# Altium project UrbanTurbinePCB.PrjPcb
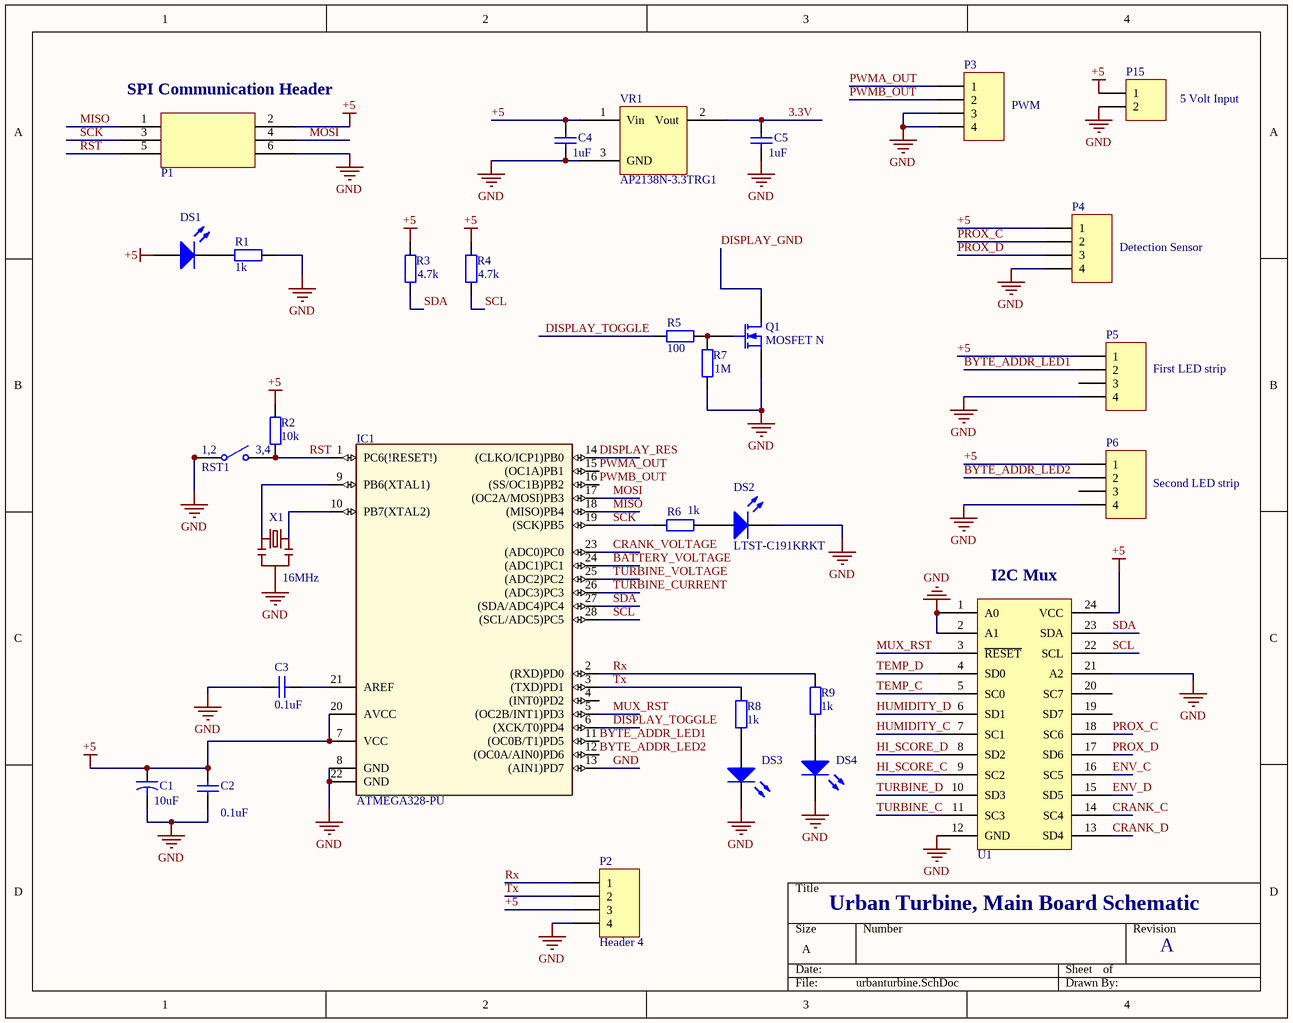
[diagram p0: urbanturbine.SchDoc]
3 sheets, 61 parts. Net scope: global (net labels, ports and power ports of the same name join across sheets).
Board files: urbanturbine_rev5a.PcbDoc, urbanturbine_rev6.PcbDoc
Sheets:
  urbanturbine.SchDoc
  sensors.SchDoc
  displays.SchDoc

## Sheet urbanturbine.SchDoc
size A

### Parts
C1  value 10uF  [CAPR5-4X5]  (hidden comment: Cap2)
C2  0.1uF  [RAD-0.1]
C3  value 0.1uF  [RAD-0.1]  (hidden comment: C1005X7R1H104K050BB)
C4  value 1uF  [RAD-0.1]  (hidden comment: Cap)
C5  value 1uF  [RAD-0.1]  (hidden comment: Cap)
DS1  LTST-C191KGKT  [LED-1]  (value not drawn)
DS2  LTST-C191KRKT  [LED-1]
DS3  LTST-C191KRKT  [LED-1]  (value not drawn)
DS4  LTST-C191KRKT  [LED-1]  (value not drawn)
IC1  ATMEGA328-PU  [*DIL28]
P1  M20-9980346  [2X3]  (value not drawn)
P2  Header 4  [HDR1X4]
P3  (no value)  [HDR1X4]
P4  (no value)  [HDR1X4]
P5  (no value)  [HDR1X4]
P6  (no value)  [HDR1X4]
P15  (no value)  [HDR1X2]
Q1  MOSFET N  [SOT23127P600-8N]
R1  value 1k  [AXIAL-0.4]  (hidden comment: RC0603JR-071KL)
R2  value 10k  [AXIAL-0.4]  (hidden comment: Res1)
R3  value 4.7k  [AXIAL-0.4]  (hidden comment: Res2)
R4  value 4.7k  [AXIAL-0.4]  (hidden comment: Res2)
R5  value 100  [AXIAL-0.4]  (hidden comment: ERJ-3EKF1002V)
R6  value 1k  [AXIAL-0.4]  (hidden comment: Res1)
R7  value 1M  [AXIAL-0.4]  (hidden comment: Res2)
R8  value 1k  [AXIAL-0.4]  (hidden comment: Res1)
R9  value 1k  [AXIAL-0.4]  (hidden comment: Res1)
RST1  PTS645SH50SMTR92 LFS  [TACTILE SWITCH SMD]  (value not drawn)
U1  TCA9548A  [TCA9548A]  (value not drawn)
VR1  AP2138N-3.3TRG1  [SOT23_M]
X1  16MHz  [RESONATOR-SMD]

### Nets
3.3V: C5.2 VR1.2(Vout)
+5: C1.1 C2.2 C4.2 DS1.1(A) IC1.7(VCC) IC1.20(AVCC) P1.2 P2.3 P4.1 P5.1 P6.1 P15.1 R2.1 R3.2 R4.2 U1.24(VCC) VR1.1(Vin)
GND: C1.2 C2.1 C3.2 C4.1 C5.1 DS2.2(K) DS3.2(K) DS4.2(K) IC1.8(GND) IC1.13((AIN1)PD7) IC1.22(GND) P1.6 P2.4 P3.3 P3.4 P4.4 P5.4 P6.4 P15.2 Q1.2(S) R1.2 R7.2 RST1.1 RST1.2 U1.1(A0) U1.2(A1) U1.12(GND) U1.21(A2) VR1.3(GND) X1.2
BATTERY_VOLTAGE: IC1.24((ADC1)PC1)
BYTE_ADDR_LED1: IC1.11((OC0B/T1)PD5) P5.2
BYTE_ADDR_LED2: IC1.12((OC0A/AIN0)PD6) P6.2
CRANK_C: U1.14(SC4)
CRANK_D: U1.13(SD4)
CRANK_VOLTAGE: IC1.23((ADC0)PC0)
DISPLAY_GND: Q1.3(D)
DISPLAY_RES: IC1.14((CLKO/ICP1)PB0)
DISPLAY_TOGGLE: IC1.6((XCK/T0)PD4) R5.2
ENV_C: U1.16(SC5)
ENV_D: U1.15(SD5)
HI_SCORE_C: U1.9(SC2)
HI_SCORE_D: U1.8(SD2)
HUMIDITY_C: U1.7(SC1)
HUMIDITY_D: U1.6(SD1)
MISO: IC1.18((MISO)PB4) P1.1
MOSI: IC1.17((OC2A/MOSI)PB3) P1.4
MUX_RST: IC1.5((OC2B/INT1)PD3) U1.3(~{RESET})
PROX_C: P4.2 U1.18(SC6)
PROX_D: P4.3 U1.17(SD6)
PWMA_OUT: IC1.15((OC1A)PB1) P3.1
PWMB_OUT: IC1.16((SS/OC1B)PB2) P3.2
RST: IC1.1(PC6(!RESET!)) P1.5 R2.2 RST1.3 RST1.4
Rx: IC1.2((RXD)PD0) P2.1 R9.1
SCK: IC1.19((SCK)PB5) P1.3 R6.1
SCL: IC1.28((SCL/ADC5)PC5) R4.1 U1.22(SCL)
SDA: IC1.27((SDA/ADC4)PC4) R3.1 U1.23(SDA)
TEMP_C: U1.5(SC0)
TEMP_D: U1.4(SD0)
TURBINE_C: U1.11(SC3)
TURBINE_CURRENT: IC1.26((ADC3)PC3)
TURBINE_D: U1.10(SD3)
TURBINE_VOLTAGE: IC1.25((ADC2)PC2)
Tx: IC1.3((TXD)PD1) P2.2 R8.1
NetC3_1: C3.1 IC1.21(AREF)
NetDS1_2: DS1.2(K) R1.1
NetDS2_1: DS2.1(A) R6.2
NetDS3_1: DS3.1(A) R8.2
NetDS4_1: DS4.1(A) R9.2
NetIC1_9: IC1.9(PB6(XTAL1)) X1.3
NetIC1_10: IC1.10(PB7(XTAL2)) X1.1
NetQ1_1: Q1.1(G) R5.1 R7.1

Not connected (* = marked no-connect by the designer): IC1 4((INT0)PD2); P5 3; P6 3; U1 19(SD7) 20(SC7)

### Notes on the sheet
- (near P1) SPI Communication Header
- 5 Volt Input
- (near P3) PWM
- (near P4) Detection Sensor
- (near P5) First LED strip
- (near P6) Second LED strip
- (near U1) I2C Mux
- Urban Turbine, Main Board Schematic
- A
- (in symbol PTS645SH50SMTR92 LFS) 1,2; 3,4

### Library data of the parts
C1 = Cap2: Capacitor; Published: 23-Sep-2002; PackageReference: CAPR5-4X5; Publisher: Altium Limited; PackageDescription: Capacitor; 2 Leads
C2-C5 = Cap: Capacitor; Published: 8-Jun-2000; LatestRevisionDate: 17-Jul-2002; LatestRevisionNote: Re-released for DXP Platform.; PackageReference: RAD-0.3; Publisher: Altium Limited; PackageDescription: Radial Cap, Thru-Hole; 2 Leads; 0.3 in Pin Spacing
  C2: Value: 0.1uF
DS1-DS4 = LED1: Typical RED GaAs LED; Published: 8-Jun-2000; LatestRevisionDate: 08-Jul-2005; LatestRevisionNote: Mech Layer 1 removed.; PackageReference: LED-1; Publisher: Altium Limited; PackageDescription: LED; 2 Leads
IC1 = ATMEGA328-PU: IC MCU 8BIT 32KB FLASH 28DIP; MF: Microchip Technology; Price: None; Package: DIP-28 Microchip Technology; Availability: Unavailable; MP: ATMEGA328-PU; SnapEDA_Link: https://www.snapeda.com/parts/ATMEGA328-PU/Microchip/view-part/?ref=snap; Value: *
P1 = M20-9980346: DIL VERTICAL PC TAIL PIN HEADER; Manufacturer: Harwin Inc.; Connector Type: Header, Unshrouded, Breakaway; Number of Positions: 6; Number of Positions Loaded: All; Pitch: 0.100" (2.54mm); Supplier 1: Digi-Key; Supplier Part Number 1: 952-2121-ND; Manufacturer Part Number: M20-9980346; RoHS: RoHS Compliant; Category: Connectors, Interconnects; Stock 1: 14297; Pricing 1: 1=0.32, 10=0.299, 25=0.2552, 50=0.2232, 100=0.2072, 250=0.18336, 500=0.17534, 1000=0.14346, 2500=0.13151 (CAD); Packaging: Bulk; Contact Type: Male Pin; Number of Rows: 2; Row Spacing: 0.100" (2.54mm); Contact Mating Length: 0.240" (6.10mm); Mounting Type: Through Hole; Termination: Solder; Fastening Type: -; Features: -; Contact Finish: Tin; Contact Finish Thickness: -; Color: Black; ComponentLink1URL: http://cdn.harwin.com/pdfs/M20-998.pdf; ComponentLink1Description: http://cdn.harwin.com/pdfs/M20-998.pdf
P2-P6 = Header 4: Header, 4-Pin; LatestRevisionDate: 17-Jul-2002; LatestRevisionNote: Re-released for DXP Platform.; Publisher: Altium Limited
P15 = Header 2: Header, 2-Pin; LatestRevisionDate: 17-Jul-2002; LatestRevisionNote: Re-released for DXP Platform.; Publisher: Altium Limited
Q1 = MOSFET N: N-channel MOSFET
R1-R9 = Res2: Resistor; Published: 8-Jun-2000; LatestRevisionDate: 17-Jul-2002; LatestRevisionNote: Re-released for DXP Platform.; PackageReference: AXIAL-0.4; Publisher: Altium Limited; PackageDescription: Axial Device, Thru-Hole; 2 Leads; 0.4 in Pin Spacing
RST1 = PTS645SH50SMTR92 LFS: SWITCH TACTILE SPST-NO 0.05A 12V; Manufacturer: C&K Components; Switch Function: Off-Mom; Contact Rating @ Voltage: 0.05A @ 12VDC; Actuator Type: Standard; Actuator Height off PCB, from Pins: 5.00mm; Actuator Orientation: Top Actuated; Outline: 6.00mm x 6.00mm; Illumination: Non-Illuminated; Operating Force: 200gf; Actuator Material: Polyamide (PA66), Nylon 6/6; Mechanical Life: 100,000 Cycles; Supplier 1: Digi-Key; Supplier Part Number 1: CKN9085CT-ND; Manufacturer Part Number: PTS645SH50SMTR92 LFS; RoHS: RoHS Compliant; Category: Switches; Stock 1: 49163; Pricing 1: 1=0.43, 10=0.418, 25=0.404, 50=0.3892, 100=0.3675, 250=0.34592, 500=0.3315 (CAD); Packaging: Cut Tape (CT); Circuit: SPST-NO; Mounting Type: Surface Mount; Termination Style: Gull Wing; Illumination Voltage (Nominal): -; Illumination Type, Color: -; Ingress Protection: -; Features: -; Switch Travel: -; Operating Temperature: -20°C ~ 60°C; ComponentLink1URL: http://www.ck-components.com/14409/pts645_25apr13.pdf/; ComponentLink1Description: http://www.ck-components.com/14409/pts645_25apr13.pdf/
U1 = TCA9548A: IIC multiplexor
VR1 = AP2138N-3.3TRG1: IC REG LINEAR 3.3V 250MA SOT23-3
X1 = CSTNE16M0VH3C000R0: CER RESONATOR 16MHZ SMD; Manufacturer: Murata Electronics North America; Manufacturer Part Number: CSTCE10M0G55Z-R0; Frequency: 10MHz; Frequency Stability: ±0.2%; Frequency Tolerance: ±0.5%; Capacitance: 33pF; Supplier 1: Digi-Key; Supplier Part Number 1: 490-4715-1-ND; RoHS: RoHS Compliant; Category: Crystals and Oscillators; Stock 1: 14995; Pricing 1: 1=0.69, 10=0.573, 50=0.5166, 100=0.4596, 500=0.43548, 1000=0.36763 (CAD); Packaging: Cut Tape (CT); Type: Ceramic; Features: Built in Capacitor; Impedance: -; Operating Temperature: -40°C ~ 125°C; Mounting Type: Surface Mount; Package / Case: 3-SMD, Non-Standard; Size / Dimension: 0.126" L x 0.051" W (3.20mm x 1.30mm); Height: 0.031" (0.80mm); ComponentLink1URL: http://www.murata.com/~/media/webrenewal/support/library/catalog/products/timingdevice/ceralock/p16e.ashx; ComponentLink1Description: http://www.murata.com/~/media/webrenewal/support/library/catalog/products/timingdevice/ceralock/p16e.ashx

## Sheet sensors.SchDoc
size A
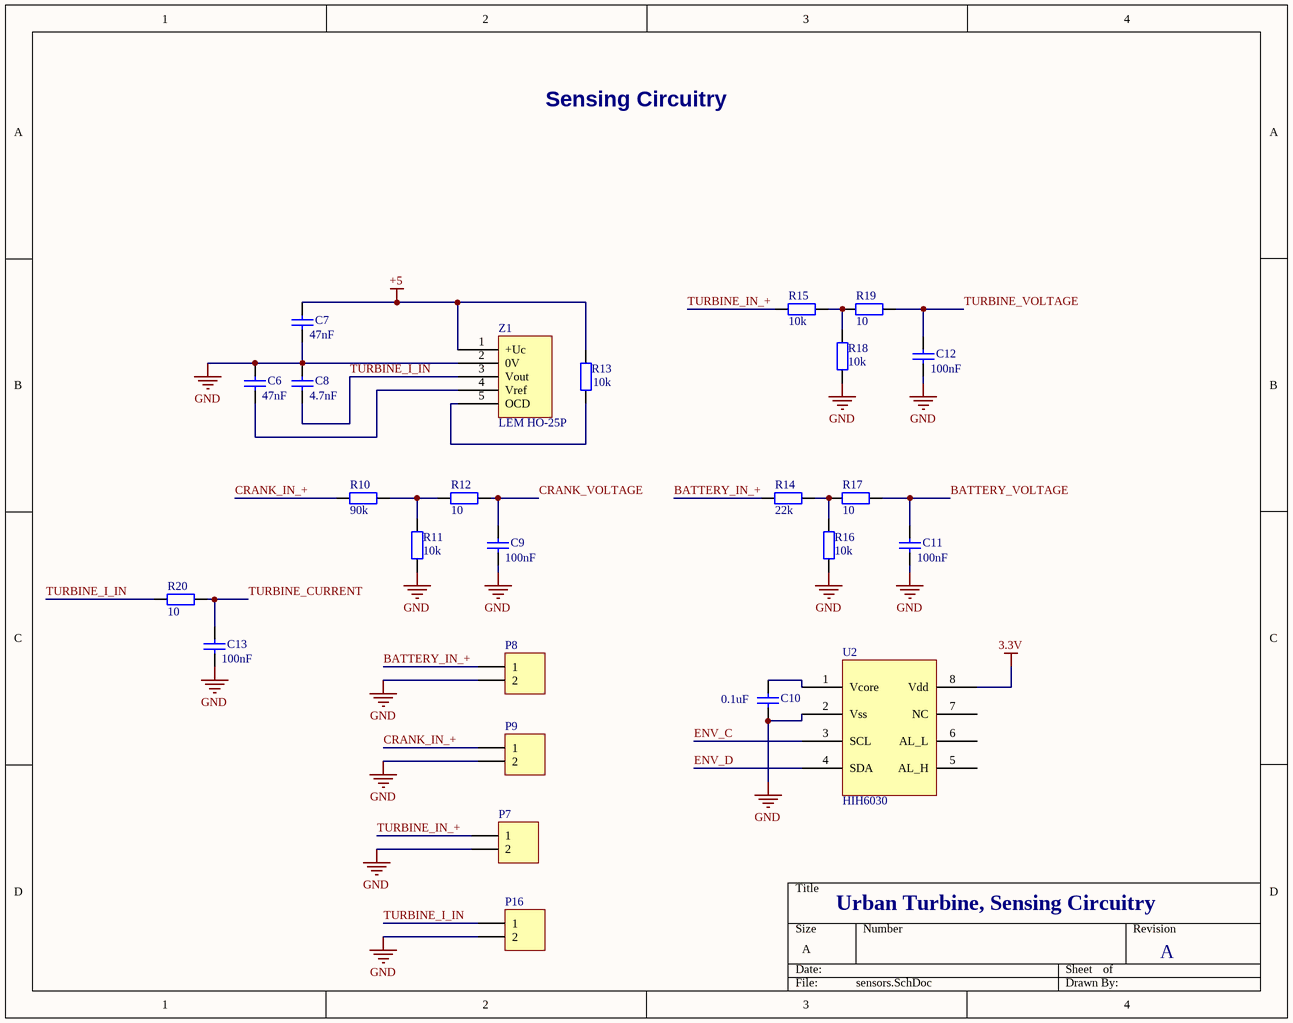
[diagram p1: sensors.SchDoc]

### Parts
C6  value 47nF  [RAD-0.1]  (hidden comment: Cap)
C7  value 47nF  [RAD-0.1]  (hidden comment: Cap)
C8  value 4.7nF  [RAD-0.1]  (hidden comment: Cap)
C9  value 100nF  [RAD-0.1]  (hidden comment: Cap)
C10  value 0.1uF  [RAD-0.1]  (hidden comment: p)
C11  value 100nF  [RAD-0.1]  (hidden comment: Cap)
C12  value 100nF  [RAD-0.1]  (hidden comment: Cap)
C13  value 100nF  [RAD-0.1]  (hidden comment: Cap)
P7  (no value)  [HDR1X2]
P8  (no value)  [HDR1X2]
P9  (no value)  [HDR1X2]
P16  (no value)  [HDR1X2]
R10  value 90k  [AXIAL-0.4]  (hidden comment: Res2)
R11  value 10k  [AXIAL-0.4]  (hidden comment: Res2)
R12  value 10  [AXIAL-0.4]  (hidden comment: Res2)
R13  value 10k  [AXIAL-0.4]  (hidden comment: Res2)
R14  value 22k  [AXIAL-0.4]  (hidden comment: Res2)
R15  value 10k  [AXIAL-0.4]  (hidden comment: Res2)
R16  value 10k  [AXIAL-0.4]  (hidden comment: Res2)
R17  value 10  [AXIAL-0.4]  (hidden comment: Res2)
R18  value 10k  [AXIAL-0.4]  (hidden comment: Res2)
R19  value 10  [AXIAL-0.4]  (hidden comment: Res2)
R20  value 10  [AXIAL-0.4]  (hidden comment: Res2)
U2  HIH6030  [HIH6300]
Z1  LEM HO-25P  [HO-25]

### Nets
3.3V: U2.8(Vdd)
+5: C7.2 R13.2 Z1.1(+Uc)
GND: C6.2 C7.1 C8.2 C9.1 C10.1 C11.1 C12.1 C13.1 P7.2 P8.2 P9.2 P16.2 R11.2 R16.2 R18.2 U2.2(Vss) Z1.2(0V)
BATTERY_IN_+: P8.1 R14.2
BATTERY_VOLTAGE: C11.2 R17.1
CRANK_IN_+: P9.1 R10.2
CRANK_VOLTAGE: C9.2 R12.1
ENV_C: U2.3(SCL)
ENV_D: U2.4(SDA)
TURBINE_CURRENT: C13.2 R20.1
TURBINE_I_IN: C8.1 P16.1 R20.2 Z1.3(Vout)
TURBINE_IN_+: P7.1 R15.2
TURBINE_VOLTAGE: C12.2 R19.1
NetC6_1: C6.1 Z1.4(Vref)
NetC10_2: C10.2 U2.1(Vcore)
NetR10_1: R10.1 R11.1 R12.2
NetR13_1: R13.1 Z1.5(OCD)
NetR14_1: R14.1 R16.1 R17.2
NetR15_1: R15.1 R18.1 R19.2

Not connected (* = marked no-connect by the designer): U2 5(AL_H) 6(AL_L) 7(NC)

### Notes on the sheet
- Sensing Circuitry
- Urban Turbine, Sensing Circuitry
- A

### Library data of the parts
C6-C13 = Cap: Capacitor; Published: 8-Jun-2000; LatestRevisionDate: 17-Jul-2002; LatestRevisionNote: Re-released for DXP Platform.; PackageReference: RAD-0.3; Publisher: Altium Limited; PackageDescription: Radial Cap, Thru-Hole; 2 Leads; 0.3 in Pin Spacing
P7-P9 P16 = Header 2: Header, 2-Pin; LatestRevisionDate: 17-Jul-2002; LatestRevisionNote: Re-released for DXP Platform.; Publisher: Altium Limited
R10-R20 = Res2: Resistor; Published: 8-Jun-2000; LatestRevisionDate: 17-Jul-2002; LatestRevisionNote: Re-released for DXP Platform.; PackageReference: AXIAL-0.4; Publisher: Altium Limited; PackageDescription: Axial Device, Thru-Hole; 2 Leads; 0.4 in Pin Spacing
U2 = HIH6030: Temp/Humidity Sensor
Z1 = LEM HO-25P: Hall Effect Current Sensor

## Sheet displays.SchDoc
size A
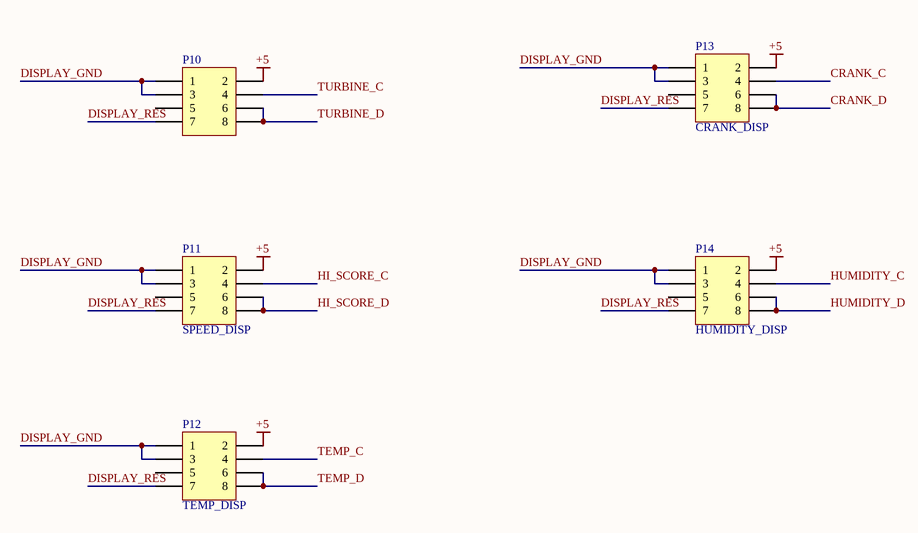
[diagram p2: displays.SchDoc]

### Parts
P10  (no value)  [HDR2X4]
P11  SPEED_DISP  [HDR2X4]
P12  TEMP_DISP  [HDR2X4]
P13  CRANK_DISP  [HDR2X4]
P14  HUMIDITY_DISP  [HDR2X4]

### Nets
+5: P10.2 P11.2 P12.2 P13.2 P14.2
CRANK_C: P13.4
CRANK_D: P13.6 P13.8
DISPLAY_GND: P10.1 P10.3 P11.1 P11.3 P12.1 P12.3 P13.1 P13.3 P14.1 P14.3
DISPLAY_RES: P10.7 P11.7 P12.7 P13.7 P14.7
HI_SCORE_C: P11.4
HI_SCORE_D: P11.6 P11.8
HUMIDITY_C: P14.4
HUMIDITY_D: P14.6 P14.8
TEMP_C: P12.4
TEMP_D: P12.6 P12.8
TURBINE_C: P10.4
TURBINE_D: P10.6 P10.8

Not connected (* = marked no-connect by the designer): P10 5; P11 5; P12 5; P13 5; P14 5

### Library data of the parts
P10-P14 = Header 4X2: Header, 4-Pin, Dual row; LatestRevisionDate: 17-Jul-2002; LatestRevisionNote: Re-released for DXP Platform.; Publisher: Altium Limited

## Nets that join several sheets
3.3V: urbanturbine (C5.2 VR1.2), sensors (U2.8)
+5: urbanturbine (17 pins), sensors (C7.2 R13.2 Z1.1), displays (5 pins)
GND: urbanturbine (30 pins), sensors (17 pins)
BATTERY_VOLTAGE: urbanturbine (IC1.24), sensors (C11.2 R17.1)
CRANK_C: urbanturbine (U1.14), displays (P13.4)
CRANK_D: urbanturbine (U1.13), displays (P13.6 P13.8)
CRANK_VOLTAGE: urbanturbine (IC1.23), sensors (C9.2 R12.1)
DISPLAY_GND: urbanturbine (Q1.3), displays (10 pins)
DISPLAY_RES: urbanturbine (IC1.14), displays (5 pins)
ENV_C: urbanturbine (U1.16), sensors (U2.3)
ENV_D: urbanturbine (U1.15), sensors (U2.4)
HI_SCORE_C: urbanturbine (U1.9), displays (P11.4)
HI_SCORE_D: urbanturbine (U1.8), displays (P11.6 P11.8)
HUMIDITY_C: urbanturbine (U1.7), displays (P14.4)
HUMIDITY_D: urbanturbine (U1.6), displays (P14.6 P14.8)
TEMP_C: urbanturbine (U1.5), displays (P12.4)
TEMP_D: urbanturbine (U1.4), displays (P12.6 P12.8)
TURBINE_C: urbanturbine (U1.11), displays (P10.4)
TURBINE_CURRENT: urbanturbine (IC1.26), sensors (C13.2 R20.1)
TURBINE_D: urbanturbine (U1.10), displays (P10.6 P10.8)
TURBINE_VOLTAGE: urbanturbine (IC1.25), sensors (C12.2 R19.1)